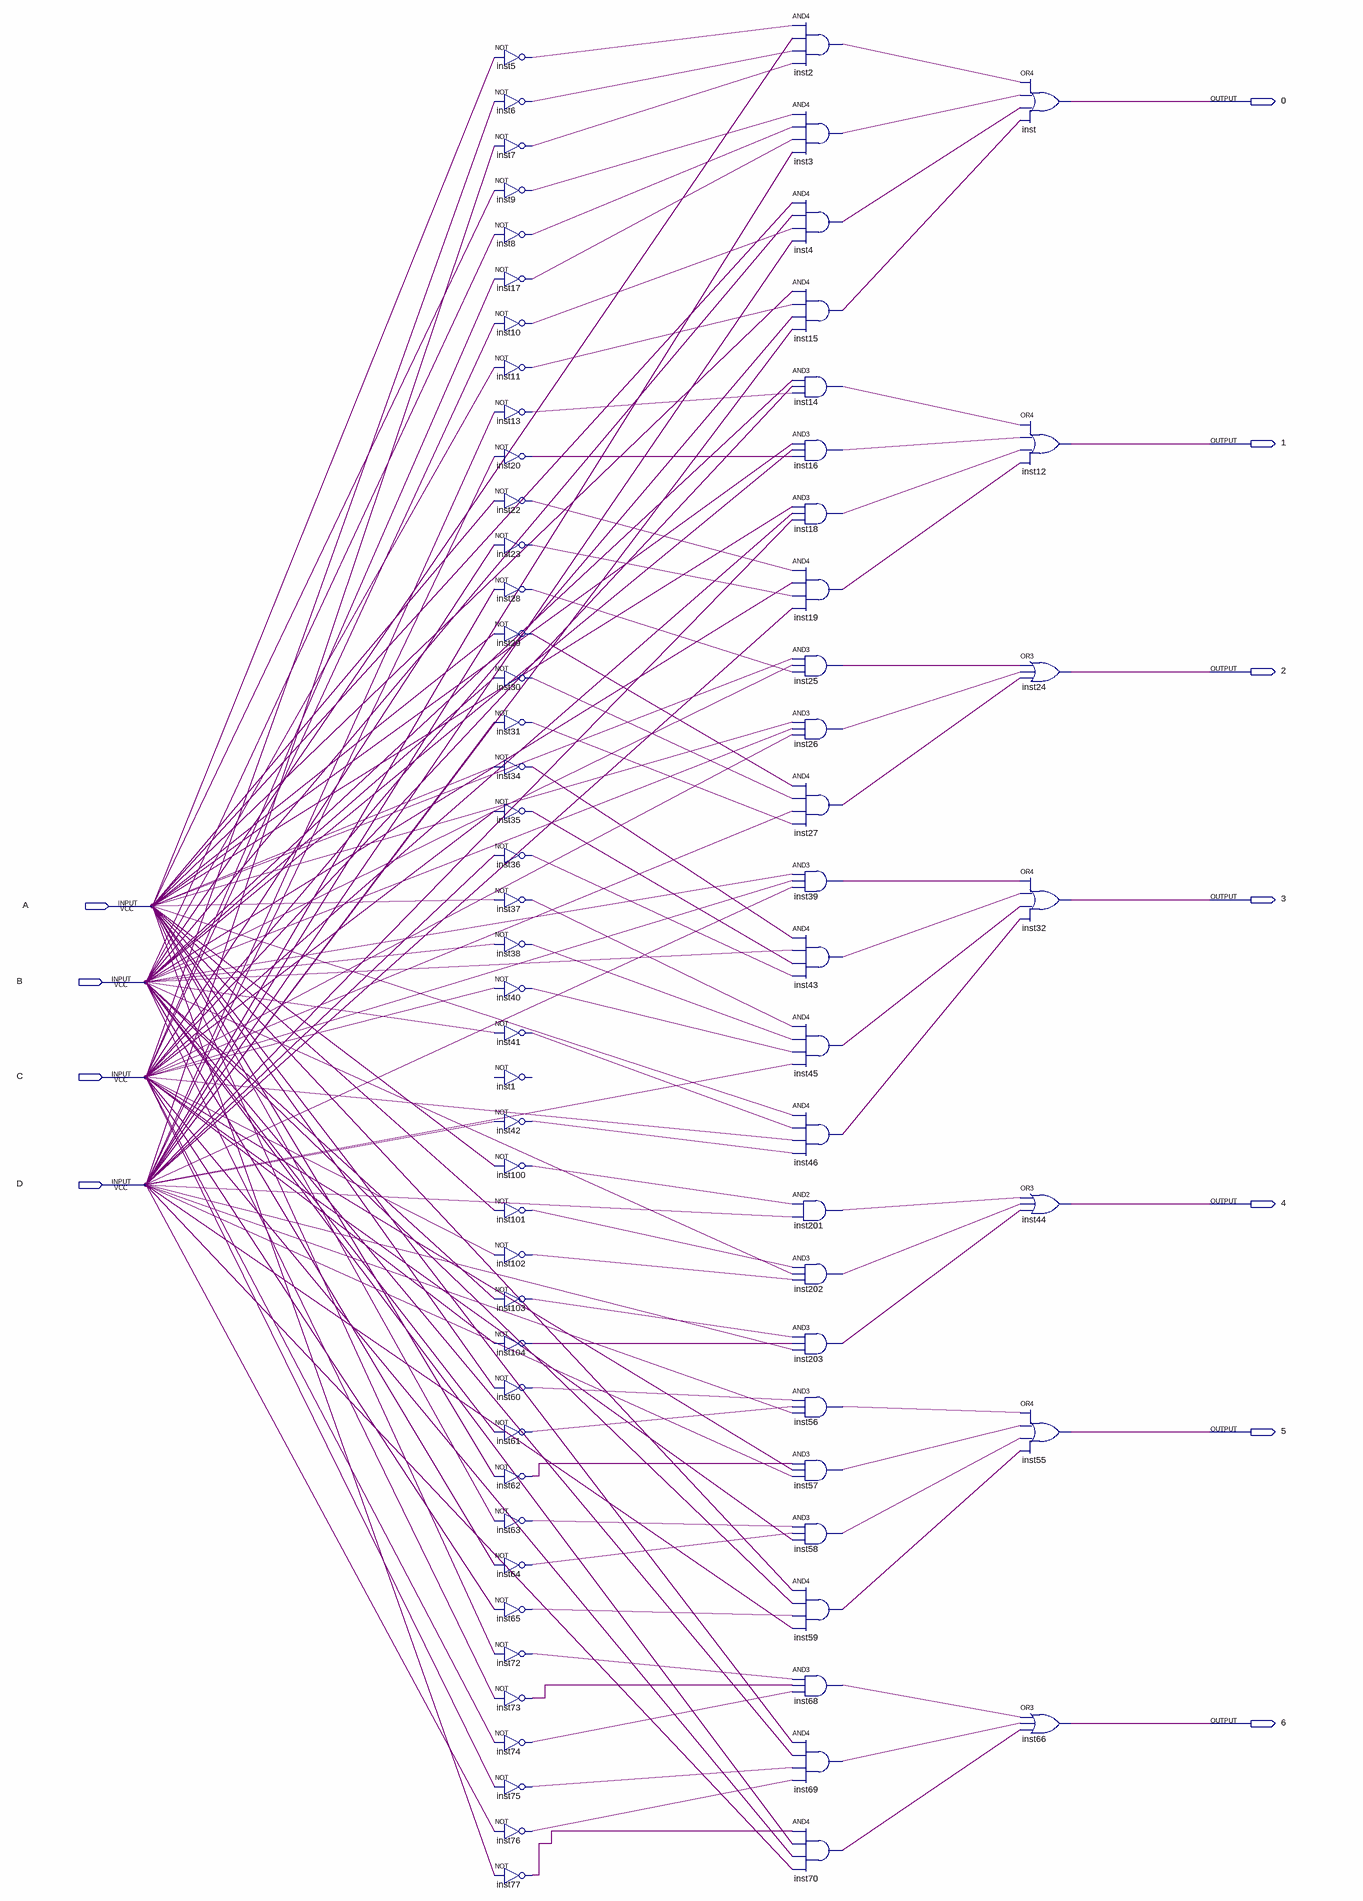
[diagram p0: schematic sheet]
// Quartus schematic display_de_segmentos.bdf as structural Verilog: 74 symbols, 11 pins
module display_de_segmentos (
  input  A,
  input  B,
  input  C,
  input  D,
  output \0 ,
  output \1 ,
  output \2 ,
  output \3 ,
  output \4 ,
  output \5 ,
  output \6 
);

  wire inst2_out, inst3_out, inst4_out, inst5_out, inst6_out, inst7_out, inst8_out, inst9_out, inst10_out,
       inst11_out, inst13_out, inst14_out, inst15_out, inst16_out, inst17_out, inst18_out, inst19_out,
       inst20_out, inst22_out, inst23_out, inst25_out, inst26_out, inst27_out, inst28_out, inst29_out,
       inst30_out, inst31_out, inst34_out, inst35_out, inst36_out, inst37_out, inst38_out, inst39_out,
       inst40_out, inst41_out, inst42_out, inst43_out, inst45_out, inst46_out, inst56_out, inst57_out,
       inst58_out, inst59_out, inst60_out, inst61_out, inst62_out, inst63_out, inst64_out, inst65_out,
       inst68_out, inst69_out, inst70_out, inst72_out, inst73_out, inst74_out, inst75_out, inst76_out,
       inst77_out, inst100_out, inst101_out, inst102_out, inst103_out, inst104_out, inst201_out, inst202_out,
       inst203_out;

  not inst5 (inst5_out, A);
  not inst6 (inst6_out, C);
  not inst7 (inst7_out, D);
  not inst9 (inst9_out, A);
  not inst8 (inst8_out, B);
  not inst17 (inst17_out, C);
  not inst10 (inst10_out, C);
  not inst11 (inst11_out, B);
  not inst13 (inst13_out, D);
  not inst20 (inst20_out, D);
  not inst22 (inst22_out, A);
  not inst23 (inst23_out, C);
  not inst28 (inst28_out, D);
  not inst29 (inst29_out, A);
  not inst30 (inst30_out, B);
  not inst31 (inst31_out, D);
  not inst34 (inst34_out, A);
  not inst35 (inst35_out, C);
  not inst36 (inst36_out, D);
  not inst37 (inst37_out, A);
  not inst38 (inst38_out, B);
  not inst40 (inst40_out, C);
  not inst41 (inst41_out, B);
  // NOT inst1 is placed but not wired
  not inst42 (inst42_out, D);
  not inst100 (inst100_out, A);
  not inst101 (inst101_out, A);
  not inst102 (inst102_out, C);
  not inst103 (inst103_out, B);
  not inst104 (inst104_out, C);
  not inst60 (inst60_out, A);
  not inst61 (inst61_out, B);
  not inst62 (inst62_out, A);
  not inst63 (inst63_out, A);
  not inst64 (inst64_out, B);
  not inst65 (inst65_out, C);
  not inst72 (inst72_out, A);
  not inst73 (inst73_out, B);
  not inst74 (inst74_out, C);
  not inst75 (inst75_out, C);
  not inst76 (inst76_out, D);
  not inst77 (inst77_out, A);
  and inst2 (inst2_out, inst5_out, B, inst6_out, inst7_out);
  and inst3 (inst3_out, inst9_out, inst8_out, inst17_out, D);
  and inst4 (inst4_out, A, B, inst10_out, D);
  and inst15 (inst15_out, A, inst11_out, C, D);
  and inst14 (inst14_out, B, C, inst13_out);
  and inst16 (inst16_out, A, B, inst20_out);
  and inst18 (inst18_out, A, C, D);
  and inst19 (inst19_out, inst22_out, B, inst23_out, D);
  and inst25 (inst25_out, A, B, inst28_out);
  and inst26 (inst26_out, A, B, C);
  and inst27 (inst27_out, inst29_out, inst30_out, C, inst31_out);
  and inst39 (inst39_out, B, C, D);
  and inst43 (inst43_out, inst34_out, B, inst35_out, inst36_out);
  and inst45 (inst45_out, inst37_out, inst38_out, inst40_out, D);
  and inst46 (inst46_out, A, inst41_out, C, inst42_out);
  and inst201 (inst201_out, inst100_out, D);
  and inst202 (inst202_out, inst101_out, B, inst102_out);
  and inst203 (inst203_out, inst103_out, inst104_out, D);
  and inst56 (inst56_out, inst60_out, inst61_out, D);
  and inst57 (inst57_out, inst62_out, C, D);
  and inst58 (inst58_out, inst63_out, inst64_out, C);
  and inst59 (inst59_out, A, B, inst65_out, D);
  and inst68 (inst68_out, inst72_out, inst73_out, inst74_out);
  and inst69 (inst69_out, A, B, inst75_out, inst76_out);
  and inst70 (inst70_out, inst77_out, B, C, D);
  or inst (\0 , inst2_out, inst3_out, inst4_out, inst15_out);
  or inst12 (\1 , inst14_out, inst16_out, inst18_out, inst19_out);
  or inst24 (\2 , inst25_out, inst26_out, inst27_out);
  or inst32 (\3 , inst39_out, inst43_out, inst45_out, inst46_out);
  or inst44 (\4 , inst201_out, inst202_out, inst203_out);
  or inst55 (\5 , inst56_out, inst57_out, inst58_out, inst59_out);
  or inst66 (\6 , inst68_out, inst69_out, inst70_out);
endmodule
